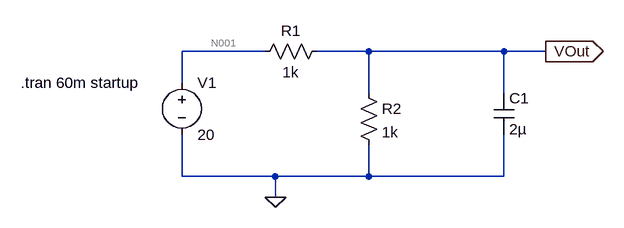
[diagram p0: schematic Draft1 Exercise 5.asc]
Draft1 Exercise 5.asc, the LTspice schematic file:
Version 4
SHEET 1 880 680
WIRE 80 80 -48 80
WIRE 240 80 160 80
WIRE 448 80 240 80
WIRE 512 80 448 80
WIRE -48 128 -48 80
WIRE 240 144 240 80
WIRE 448 144 448 80
WIRE -48 272 -48 208
WIRE 96 272 -48 272
WIRE 240 272 240 224
WIRE 240 272 96 272
WIRE 448 272 448 208
WIRE 448 272 240 272
WIRE 96 304 96 272
FLAG 96 304 0
FLAG 512 80 VOut
IOPIN 512 80 Out
SYMBOL voltage -48 112 R0
SYMATTR InstName V1
SYMATTR Value 20
SYMBOL res 176 64 R90
WINDOW 0 0 56 VBottom 2
WINDOW 3 32 56 VTop 2
SYMATTR InstName R1
SYMATTR Value 1k
SYMBOL res 224 128 R0
SYMATTR InstName R2
SYMATTR Value 1k
SYMBOL cap 432 144 R0
SYMATTR InstName C1
SYMATTR Value 2µ
TEXT -296 128 Left 2 !.tran 60m startup

The netlist it stands for:
* Draft1 Exercise 5.asc
V1 N001 0 20
R1 VOut N001 1k
R2 VOut 0 1k
C1 VOut 0 2µ
.tran 60m startup
.backanno
.end

* Results of the author's LTspice run, read from the files saved beside the schematic
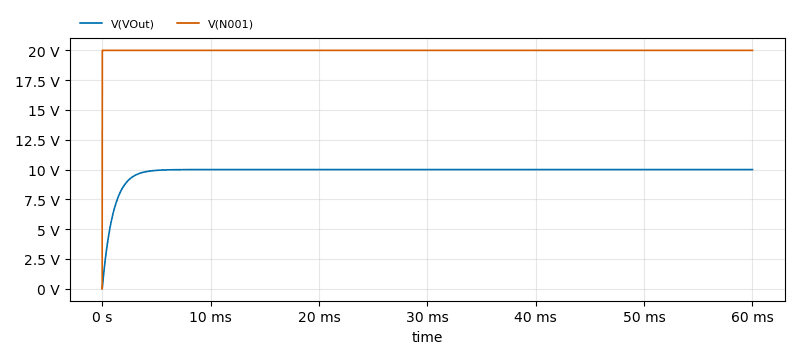
[diagram p1: Transient Analysis of Draft1 Exercise 5.asc, plotted from the saved traces]
* Transient Analysis, 1 run:
*   V(VOut): min 0 V, max 10 V, average 9.831 V, rms 9.873 V, last 10 V
*   V(N001): min 0 V, max 20 V, average 20 V, rms 20 V, last 20 V